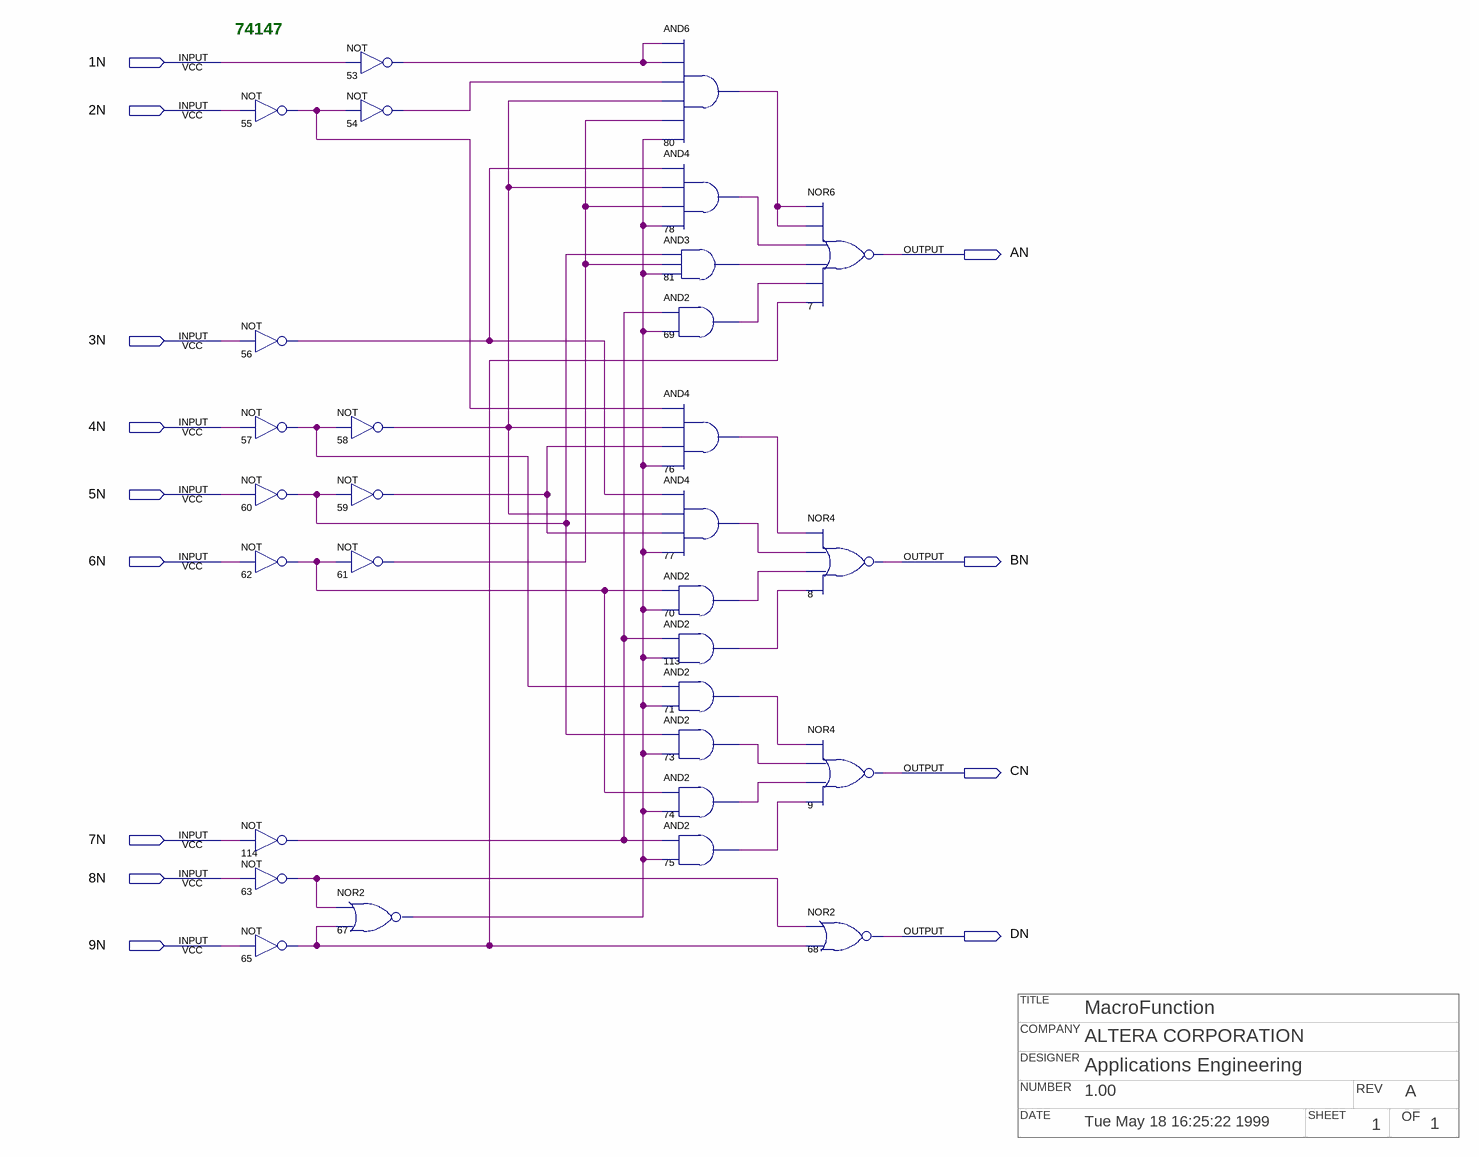
[diagram p0: schematic sheet]
// Quartus schematic 74147.bdf as structural Verilog: 30 symbols, 13 pins
// Title block: TITLE: MacroFunction; COMPANY: ALTERA CORPORATION; DESIGNER: Applications Engineering; NUMBER: 1.00; REV: A; DATE: Tue May 18 16:25:22 1999; SHEET: 1; OF: 1
module \74147  (
  input  \1N ,
  input  \2N ,
  input  \3N ,
  input  \4N ,
  input  \5N ,
  input  \6N ,
  input  \7N ,
  input  \8N ,
  input  \9N ,
  output AN,
  output BN,
  output CN,
  output DN
);

  wire n53_out, n54_out, n55_out, n56_out, n57_out, n58_out, n59_out, n60_out, n61_out, n62_out, n63_out,
       n65_out, n67_out, n69_out, n70_out, n71_out, n73_out, n74_out, n75_out, n76_out, n77_out, n78_out,
       n80_out, n81_out, n113_out, n114_out;

  not u_55 (n55_out, \2N );
  not u_56 (n56_out, \3N );
  not u_57 (n57_out, \4N );
  not u_60 (n60_out, \5N );
  not u_62 (n62_out, \6N );
  not u_114 (n114_out, \7N );
  not u_63 (n63_out, \8N );
  not u_65 (n65_out, \9N );
  not u_53 (n53_out, \1N );
  not u_54 (n54_out, n55_out);
  not u_58 (n58_out, n57_out);
  not u_59 (n59_out, n60_out);
  not u_61 (n61_out, n62_out);
  nor u_67 (n67_out, n63_out, n65_out);
  and u_80 (n80_out, n53_out, n53_out, n54_out, n58_out, n61_out, n67_out);
  and u_78 (n78_out, n56_out, n58_out, n61_out, n67_out);
  and u_81 (n81_out, n60_out, n61_out, n67_out);
  and u_69 (n69_out, n114_out, n67_out);
  and u_76 (n76_out, n55_out, n58_out, n59_out, n67_out);
  and u_77 (n77_out, n56_out, n58_out, n59_out, n67_out);
  and u_70 (n70_out, n62_out, n67_out);
  and u_113 (n113_out, n114_out, n67_out);
  and u_71 (n71_out, n57_out, n67_out);
  and u_73 (n73_out, n60_out, n67_out);
  and u_74 (n74_out, n62_out, n67_out);
  and u_75 (n75_out, n114_out, n67_out);
  nor u_7 (AN, n80_out, n80_out, n78_out, n81_out, n69_out, n65_out);
  nor u_8 (BN, n76_out, n77_out, n70_out, n113_out);
  nor u_9 (CN, n71_out, n73_out, n74_out, n75_out);
  nor u_68 (DN, n63_out, n65_out);

  // Notes on the sheet:
  //   74147
endmodule
